# Altium schematic sheet servo.SchDoc
size A; SheetNumber: 1; SheetTotal: 1
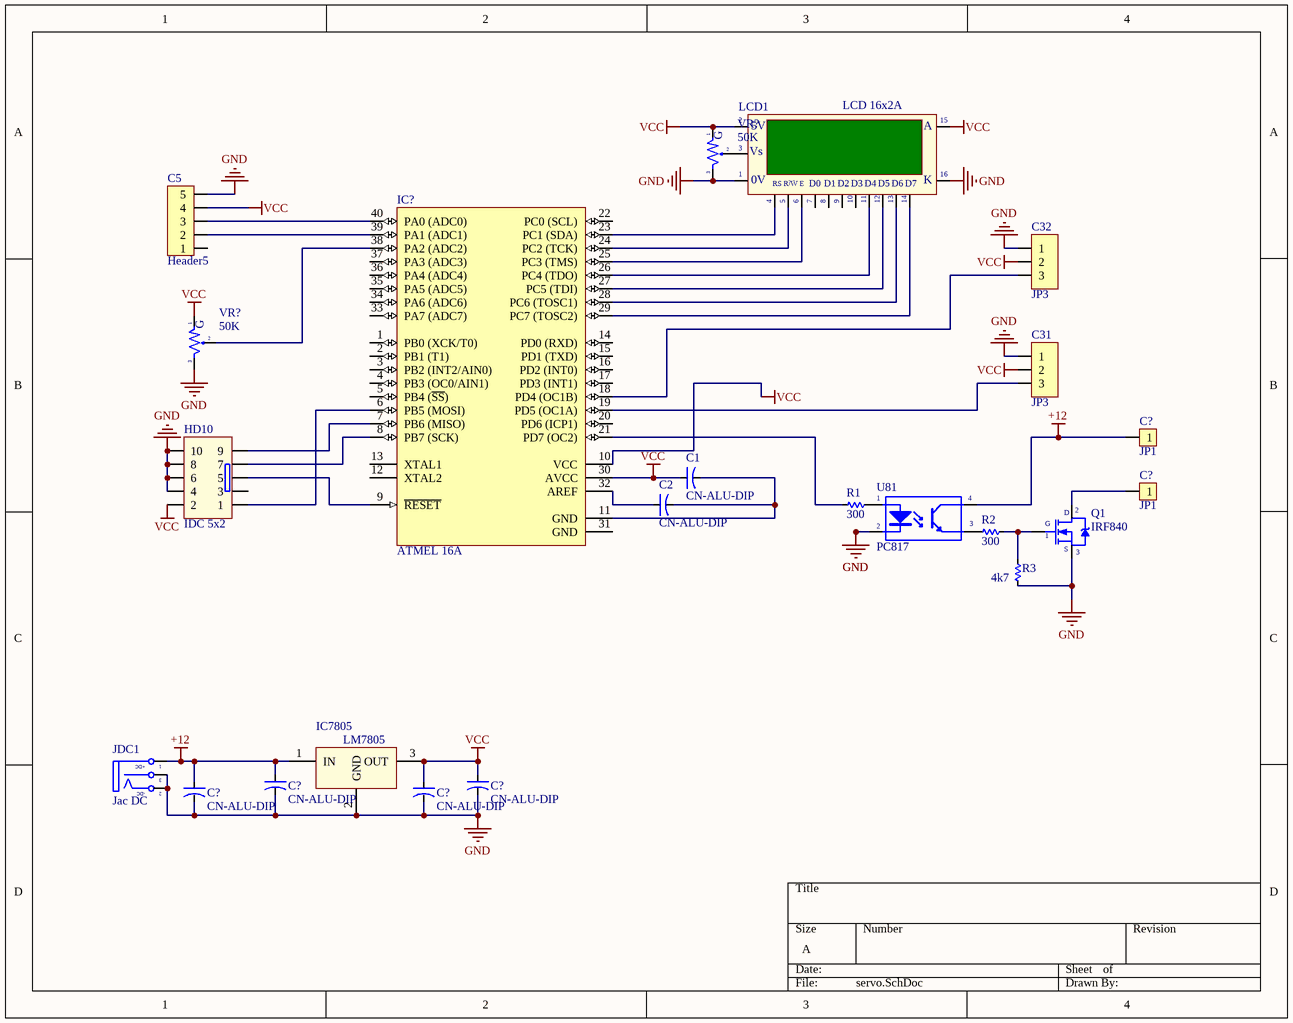
[diagram p0: servo.SchDoc]

## Parts
(Parts that share a designator on the sheet are numbered #1, #2 ... from top to bottom, then left to right.)
C1  CN-ALU-DIP  [CA-ALU-2.54]
C2  CN-ALU-DIP  [CA-ALU-2.54]
C5  Header5  [HDR5]
C31  JP3  [JP3-D1C]
C32  JP3  [JP3-D1C]
C?#1  JP1  [JP1-D1T]
C?#2  JP1  [JP1-D1T]
C?#3  CN-ALU-DIP  [CA-ALU-2.54]
C?#4  CN-ALU-DIP  [CA-ALU-2.54]
C?#5  CN-ALU-DIP  [CA-ALU-2.54]
C?#6  CN-ALU-DIP  [CA-ALU-2.54]
HD10  IDC 5x2  [IDC10-BH]
IC7805  LM7805  [QTO-220]
IC?  ATMEL 16A  [DIP40/W0.6]
JDC1  Jac DC  [DC-IN]
LCD1  LCD 16x2A  [LCD16X2]
Q1  IRF840  [TO220H1]
R1  300  [RES-1/2W]
R2  300  [RES-1/2W]
R3  4k7  [RES-1/2W]
U81  PC817  [DIP4]
VR?#1  50K  [VR-S2]
VR?#2  50K  [VR-S1]

## Nets
+12: C?#1.1 C?#3.1 C?#5.1 IC7805.1(IN) JDC1.1(T) U81.4(C)
GND: C5.5 C31.1 C32.1 C?#3.2 C?#4.2 C?#5.2 C?#6.2 HD10.4 HD10.6 HD10.8 HD10.10 IC7805.2(GND) JDC1.2(TN) JDC1.3(S) LCD1.1(GND) LCD1.16(K) Q1.3(S) R3.2 U81.2(K) VR?#1.3 VR?#2.3
VCC: C1.1 C5.4 C31.2 C32.2 C?#4.1 C?#6.1 HD10.2 IC7805.3(OUT) IC?.10(VCC) IC?.30(AVCC) LCD1.2(VDD) LCD1.15(A) VR?#1.1 VR?#2.1
NetC1_2: C1.2 C2.2 IC?.11(GND)
NetC2_1: C2.1 IC?.32(AREF)
NetC5_2: C5.2 IC?.39(PA1_(ADC1))
NetC5_3: C5.3 IC?.40(PA0_(ADC0))
NetC31_3: C31.3 IC?.19(PD5_(OC1A))
NetC32_3: C32.3 IC?.18(PD4_(OC1B))
NetC?#2_1: C?#2.1 Q1.2(D)
NetHD10_1: HD10.1 IC?.6(PB5_(MOSI))
NetHD10_5: HD10.5 IC?.9(~{RESET})
NetHD10_7: HD10.7 IC?.8(PB7_(SCK))
NetHD10_9: HD10.9 IC?.7(PB6_(MISO))
NetIC?_21: IC?.21(PD7_(OC2)) R1.2
NetIC?_23: IC?.23(PC1_(SDA)) LCD1.4(RS)
NetIC?_24: IC?.24(PC2_(TCK)) LCD1.5(R/~{W})
NetIC?_25: IC?.25(PC3_(TMS)) LCD1.6(~{EN})
NetIC?_26: IC?.26(PC4_(TDO)) LCD1.11(D4)
NetIC?_27: IC?.27(PC5_(TDI)) LCD1.12(D5)
NetIC?_28: IC?.28(PC6_(TOSC1)) LCD1.13(D6)
NetIC?_29: IC?.29(PC7_(TOSC2)) LCD1.14(D7)
NetIC?_38: IC?.38(PA2_(ADC2)) VR?#2.2
NetLCD1_3: LCD1.3(VEE) VR?#1.2
NetQ1_1: Q1.1(G) R2.1 R3.1
NetR1_1: R1.1 U81.1(A)
NetR2_2: R2.2 U81.3(E)

Not connected (* = marked no-connect by the designer): C5 1; HD10 3; IC? 1(PB0_(XCK/T0)) 2(PB1_(T1)) 3(PB2_(INT2/AIN0)) 4(PB3_(OC0/AIN1)) 5(PB4_(~{SS})) 12(XTAL2) 13(XTAL1) 14(PD0_(RXD)) 15(PD1_(TXD)) 16(PD2_(INT0)) 17(PD3_(INT1)) 20(PD6_(ICP1)) 22(PC0_(SCL)) 31(GND) 33(PA7_(ADC7)) 34(PA6_(ADC6)) 35(PA5_(ADC5)) 36(PA4_(ADC4)) 37(PA3_(ADC3)); LCD1 7(D0) 8(D1) 9(D2) 10(D3)

## Notes on the sheet
- (in symbol DCIN) +DC; -DC
- (in symbol LCD16x2A) 5V; Vs; |; 0V; R/W; E
- (in symbol VR-S) G

## Library data of the parts
C1 C2 C?#3-C?#6 = CN-ALU-DIP: Capacitor (Semiconductor SIM Model); Value: 104; LatestRevisionDate: 17-Jul-2002; LatestRevisionNote: Re-released for DXP Platform.; PackageReference: C1206; Publisher: Altium Limited
C5 = Header5: Header IDC, 5 x 1 Pin Vertical 2.54mm Pitch (Non-Boxed, Male); Manufacturer: W¨¹rth Elektronik eiSos GmbH; partNo: 613002143121; ComponentLink1 Description: Manufacturer; ComponentLink2 Description: Datasheet; NoPins: 02; Created Date: 29 March 2013; ComponentLink1URL: http://www.we-online.com; ComponentLink2URL: http://katalog.we-online.de/em/datasheet/6130xx143121.pdf; Created by: Karrer Zheng
C31 C32 = JP3: WR-PHD 2.54 mm Angled Socket Header; Manufacturer: W¨¹rth Elektronik eiSos GmbH; partNo: 613003143121; ComponentLink1 Description: Manufacturer; ComponentLink2 Description: Datasheet; NoPins: 03; Created Date: 29 March 2013; ComponentLink1URL: http://www.we-online.com; ComponentLink2URL: http://katalog.we-online.de/em/datasheet/6130xx143121.pdf; Created by: Karrer Zheng
C?#1 C?#2 = JP1: WR-PHD 2.54 mm Angled Socket Header; Manufacturer: W¨¹rth Elektronik eiSos GmbH; partNo: 613002143121; ComponentLink1 Description: Manufacturer; ComponentLink2 Description: Datasheet; NoPins: 02; Created Date: 29 March 2013; ComponentLink1URL: http://www.we-online.com; ComponentLink2URL: http://katalog.we-online.de/em/datasheet/6130xx143121.pdf; Created by: Karrer Zheng
HD10 = IDC 5X2: Value: Header 5x2
IC7805 = LM78xx: On ap +, from + 5 to + 24VDC; Value: LM7805
IC? = ATmega16A-PU: 8-Bit AVR Microcontroller with 16K Bytes of In-System Programmable Flash Memory; Value: Atmega 16L
JDC1 = DCIN: Jac DC input; Value: Jac DC
LCD1 = LCD16x2A: LCD dipslay 16 char, 2 line; Value: LCD16x2A
Q1 = IRF840: MOSFET N - CHANNEL 500V - 0.75 - 8A - TO-220; Value: IRF840
R1-R3 = Res: Manufacturer: Generic Components; Class: Passive; SubClass: R; Published: 08/06/2000; Publisher: Altium Hobart Technology Centre
U81 = PC817: Single Opto; Value: PC817
VR?#1 VR?#2 = VR-S: Var Resistor; Value: Volume 50k